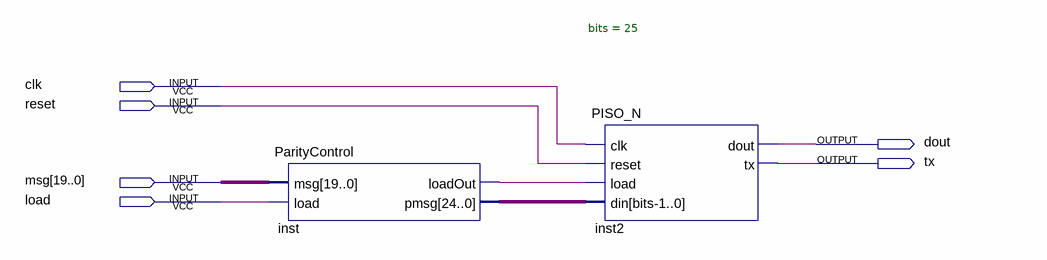
[diagram p0: schematic sheet]
// Quartus schematic Transmitter.bdf as structural Verilog: 2 symbols, 6 pins
module Transmitter (
  input  clk,
  input  reset,
  input  [19:0] msg,
  input  load,
  output dout,
  output tx
);

  wire inst_loadout;
  wire [24:0] inst_pmsg;

  ParityControl inst (.msg(msg), .load(load), .loadOut(inst_loadout), .pmsg(inst_pmsg));
  PISO_N #(.bits(25)) inst2 (.clk(clk), .reset(reset), .load(inst_loadout), .din(inst_pmsg), .dout(dout), .tx(tx));
endmodule
